# EAGLE design shoe_board (EAGLE 9.5.0)
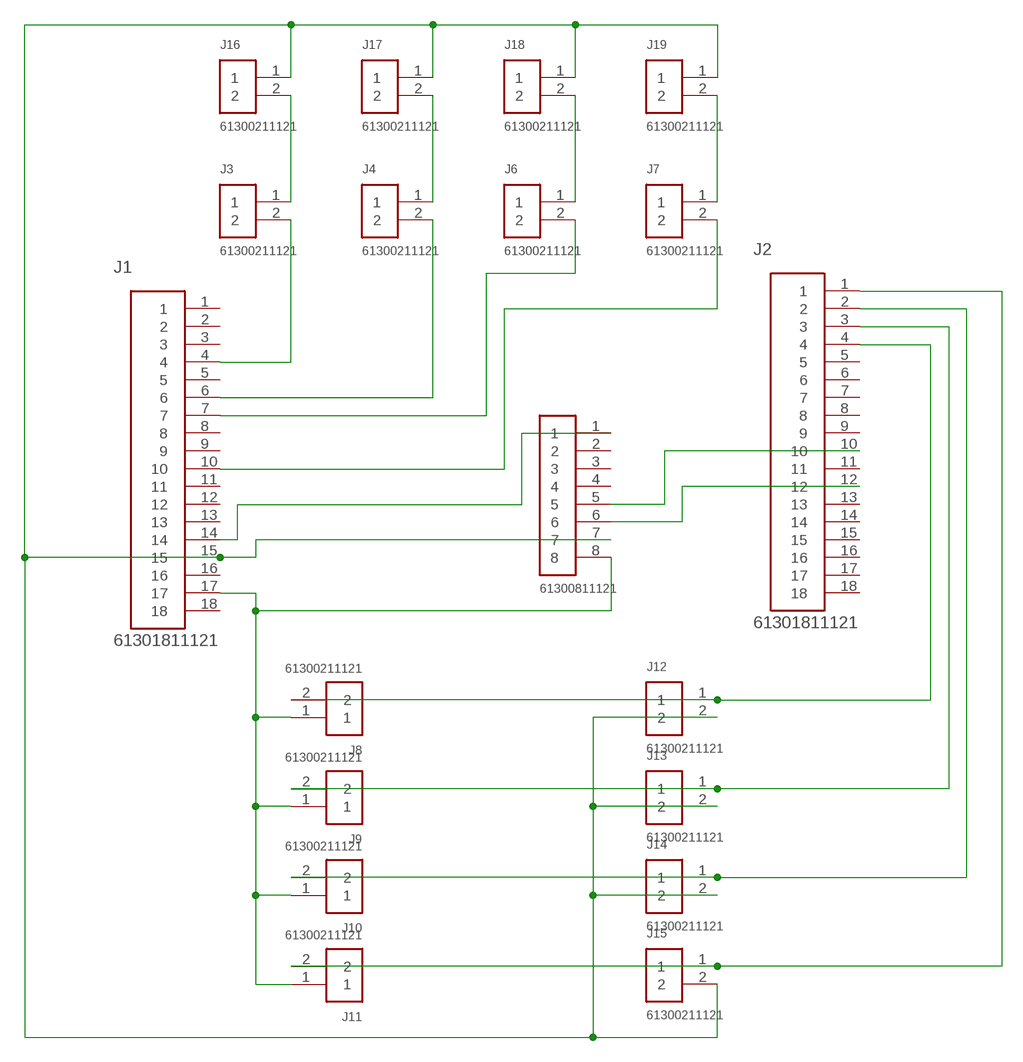
[diagram p0: schematic, sheet 1]

## Parts
J1  61301811121  [61301811121]
J2  61301811121  [61301811121]
J3  61300211121  [61300211121]
J4  61300211121  [61300211121]
J6  61300211121  [61300211121]
J7  61300211121  [61300211121]
J8  61300211121  [61300211121]
J9  61300211121  [61300211121]
J10  61300211121  [61300211121]
J11  61300211121  [61300211121]
J12  61300211121  [61300211121]
J13  61300211121  [61300211121]
J14  61300211121  [61300211121]
J15  61300211121  [61300211121]
J16  61300211121  [61300211121]
J17  61300211121  [61300211121]
J18  61300211121  [61300211121]
J19  61300211121  [61300211121]
J20  61300811121  [61300811121]

## Nets
N$1: J1.4 J3.2
N$2: J1.6 J4.2
N$3: J1.7 J6.2
N$4: J1.10 J7.2
N$5: J3.1 J16.2
N$6: J4.1 J17.2
N$7: J6.1 J18.2
N$8: J7.1 J19.2
N$9: J2.10 J20.5
N$10: J1.15 J12.2 J13.2 J14.2 J15.2 J16.1 J17.1 J18.1 J19.1 J20.7
N$11: J2.1 J11.2 J15.1
N$12: J2.2 J10.2 J14.1
N$13: J2.3 J9.2 J13.1
N$14: J2.4 J8.2 J12.1
N$15: J1.14 J20.1
N$16: J2.12 J20.6
N$19: J1.17 J8.1 J9.1 J10.1 J11.1 J20.8
Unconnected: J1.1 J1.2 J1.3 J1.5 J1.8 J1.9 J1.11 J1.12 J1.13 J1.16 J1.18 J2.5 J2.6 J2.7 J2.8 J2.9 J2.11 J2.13 J2.14 J2.15 J2.16 J2.17 J2.18 J20.2 J20.3 J20.4

## Library data of the parts
J1 J2 = Headers:61301811121: CONN HEADER VERT 18POS 2.54MM Manufacturer's datasheet <https://katalog.we-online.de/em/datasheet/6130xx11121.pdf>; CREATED_BY: PCBLayout.com; DIGIKEY_PART_NUMBER: 732-5328-ND; MANUFACTURER: Wurth Electronics Inc.; MPN: 61301811121
J3 J4 J6-J19 = Headers:61300211121: CONN HEADER VERT 2POS 2.54MM Manufacturer's datasheet <https://katalog.we-online.de/em/datasheet/6130xx11121.pdf>; CREATED_BY: PCBLayout.com; DIGI_KEY_PART_NUMBER: 732-5315-ND; MANUFACTURER: Wurth Electronics Inc.; MPN: 61300211121
J20 = Headers:61300811121: CONN HEADER VERT 8POS 2.54MM Manufacturer's datasheet <https://katalog.we-online.de/em/datasheet/6130xx11121.pdf>; CREATED_BY: PCBLayout.com; DIGI_KEY_PART_NUMBER: 732-5321-ND; MANUFACTURER: Wurth Electronics Inc.; MPN: 61300811121

## Board
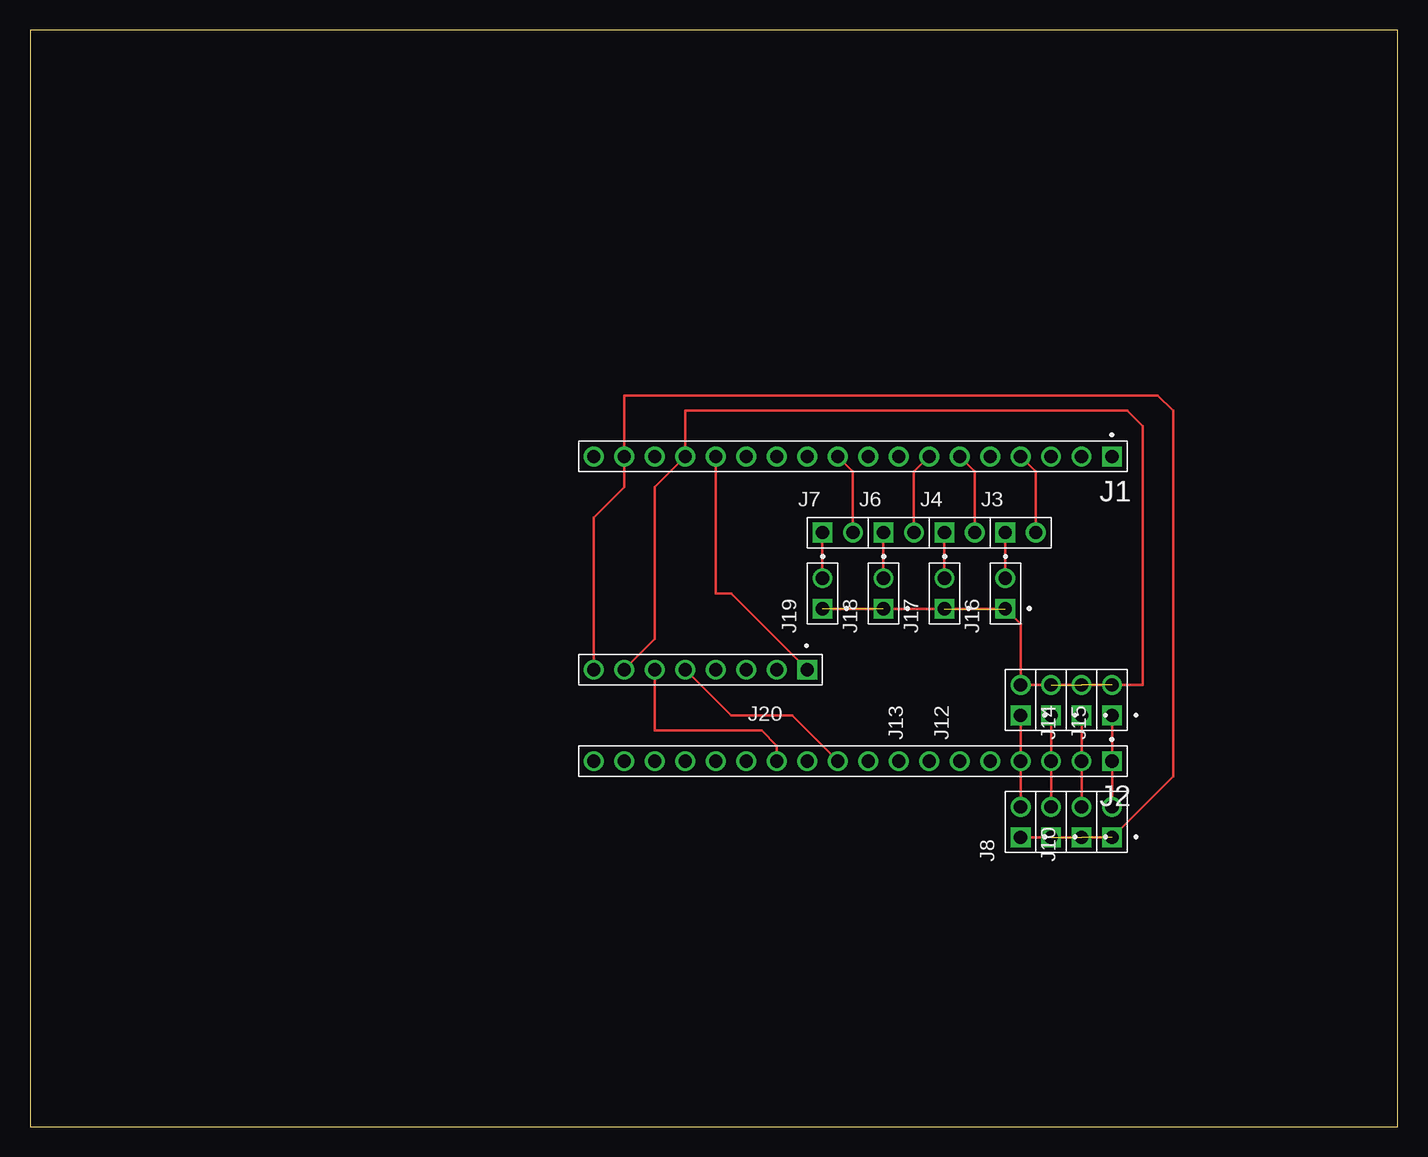
[diagram p1: board, top side]

Size 113.97 x 91.43 mm. Coordinates in mm from the lower left corner, seen from the top.
Outline: 0,0 113.97,0 113.97,91.43 0,91.43 0,0
Copper layers (1*16): Top 0.035mm / dielectric 1.5mm / Bottom 0.035mm
Design rules "OthermillDRC_1_32_v2": minimum track width 8mil, minimum drill 0.8mm, track to track 0.794003125mm, track to pad 0.794003125mm, pad to pad 0.794003125mm, via to via 0.794003125mm, smd to smd 0mil, copper to edge 0mil, drill to drill 1mil, minimum pad ring 10mil, minimum via ring 10mil, stop-mask expansion 1mil, vias tented up to drill 30mil, thermal gap 10mil

### Footprints (pad centres in the part's own frame; a part is rotated, then mirrored left to right if it is on the bottom)
61301811121 = drill 1.1 square: 1 -21.59,0 | drill 1.1: 2 -19.05,0; 3 -16.51,0; 4 -13.97,0; 5 -11.43,0; 6 -8.89,0; 7 -6.35,0; 8 -3.81,0; 9 -1.27,0; 10 1.27,0; 11 3.81,0; 12 6.35,0; 13 8.89,0; 14 11.43,0; 15 13.97,0; 16 16.51,0; 17 19.05,0; 18 21.59,0
61300211121 = drill 1.1 square: 1 -1.27,0 | drill 1.1: 2 1.27,0
61300811121 = drill 1.1 square: 1 -8.89,0 | drill 1.1: 2 -6.35,0; 3 -3.81,0; 4 -1.27,0; 5 1.27,0; 6 3.81,0; 7 6.35,0; 8 8.89,0

### Placement (x,y rotation side)
J1  68.58,55.88 180 top
J2  68.58,30.48 180 top
J3  82.55,49.53 0 top
J4  77.47,49.53 0 top
J6  72.39,49.53 0 top
J7  67.31,49.53 0 top
J8  82.55,25.4 90 top
J9  85.09,25.4 90 top
J10  87.63,25.4 90 top
J11  90.17,25.4 90 top
J12  82.55,35.56 90 top
J13  85.09,35.56 90 top
J14  87.63,35.56 90 top
J15  90.17,35.56 90 top
J16  81.28,44.45 90 top
J17  76.2,44.45 90 top
J18  71.12,44.45 90 top
J19  66.04,44.45 90 top
J20  55.88,38.1 180 top

### Tracks (layer width: path | path; a pad name or v marks a point on that pad's centre or on a via)
N$1
  Top 0.203: J1.4 83.82,54.61 J3.2
N$2
  Top 0.203: J1.6 78.74,54.61 J4.2
N$3
  Top 0.203: J1.7 73.66,54.61 J6.2
N$4
  Top 0.203: J1.10 68.58,54.61 J7.2
N$5
  Top 0.203: J3.1 J16.2
N$6
  Top 0.203: J4.1 J17.2
N$7
  Top 0.203: J6.1 J18.2
N$8
  Top 0.203: J7.1 J19.2
N$9
  Top 0.203: J20.5 58.42,34.29 63.5,34.29 J2.10
N$10  (4 unrouted)
  Top 0.203: J19.1 J16.1 82.55,41.91 J12.2 J15.2 92.71,36.83 92.71,58.42 91.44,59.69 54.61,59.69 J1.15 52.07,53.34 52.07,40.64 J20.7
N$11
  Top 0.203: J11.2 J2.1 J15.1
N$12
  Top 0.203: J10.2 J2.2 J14.1
N$13
  Top 0.203: J9.2 J2.3 J13.1
N$14
  Top 0.203: J8.2 J2.4 J12.1
N$15
  Top 0.203: J1.14 57.15,44.45 58.42,44.45 J20.1
N$16
  Top 0.203: J20.6 52.07,33.02 60.96,33.02 62.23,31.75 J2.12
N$19  (2 unrouted)
  Top 0.203: J8.1 J11.1 95.25,29.21 95.25,59.69 93.98,60.96 49.53,60.96 J1.17 49.53,53.34 46.99,50.8 J20.8